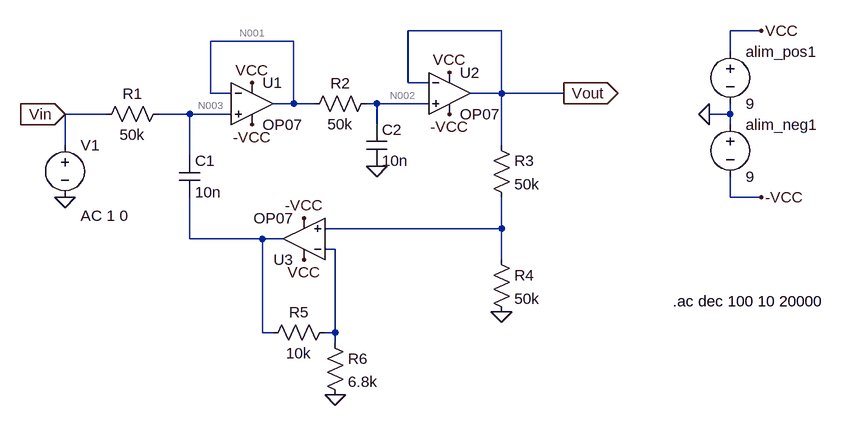
[diagram p0: schematic filtre_ordre_2_resonance.asc]
filtre_ordre_2_resonance.asc, the LTspice schematic file:
Version 4.1
SHEET 1 1324 836
WIRE 624 32 480 32
WIRE 1024 32 976 32
WIRE 304 48 176 48
WIRE 976 64 976 32
WIRE 480 112 480 32
WIRE 512 112 480 112
WIRE 176 128 176 48
WIRE 208 128 176 128
WIRE 624 128 624 32
WIRE 624 128 576 128
WIRE 720 128 624 128
WIRE 304 144 304 48
WIRE 304 144 272 144
WIRE 336 144 304 144
WIRE 432 144 416 144
WIRE 512 144 432 144
WIRE 16 160 -48 160
WIRE 144 160 96 160
WIRE 208 160 144 160
WIRE 976 160 976 144
WIRE 976 160 944 160
WIRE 432 176 432 144
WIRE 976 176 976 160
WIRE -48 208 -48 160
WIRE 624 208 624 128
WIRE 144 224 144 160
WIRE 976 288 976 256
WIRE 1024 288 976 288
WIRE 624 336 624 288
WIRE 624 336 352 336
WIRE 144 352 144 288
WIRE 256 352 144 352
WIRE 288 352 256 352
WIRE 368 368 352 368
WIRE 624 384 624 336
WIRE 256 496 256 352
WIRE 272 496 256 496
WIRE 368 496 368 368
WIRE 368 496 352 496
WIRE 368 512 368 496
FLAG 432 240 0
FLAG 624 464 0
FLAG 368 592 0
FLAG 720 128 Vout
IOPIN 720 128 Out
FLAG -48 160 Vin
IOPIN -48 160 In
FLAG -48 288 0
FLAG 944 160 0
FLAG 1024 32 VCC
FLAG 1024 288 -VCC
FLAG 240 112 VCC
FLAG 320 384 VCC
FLAG 544 96 VCC
FLAG 544 160 -VCC
FLAG 320 320 -VCC
FLAG 240 176 -VCC
SYMBOL res 112 144 R90
WINDOW 0 0 56 VBottom 2
WINDOW 3 32 56 VTop 2
SYMATTR InstName R1
SYMATTR Value 50k
SYMBOL cap 128 224 R0
SYMATTR InstName C1
SYMATTR Value 10n
SYMBOL cap 416 176 R0
SYMATTR InstName C2
SYMATTR Value 10n
SYMBOL res 432 128 R90
WINDOW 0 0 56 VBottom 2
WINDOW 3 32 56 VTop 2
SYMATTR InstName R2
SYMATTR Value 50k
SYMBOL res 608 192 R0
SYMATTR InstName R3
SYMATTR Value 50k
SYMBOL res 608 368 R0
SYMATTR InstName R4
SYMATTR Value 50k
SYMBOL res 368 480 R90
WINDOW 0 0 56 VBottom 2
WINDOW 3 32 56 VTop 2
SYMATTR InstName R5
SYMATTR Value 10k
SYMBOL res 352 496 R0
SYMATTR InstName R6
SYMATTR Value 6.8k
SYMBOL voltage -48 192 R0
WINDOW 123 24 124 Left 2
WINDOW 39 0 0 Left 0
SYMATTR Value2 AC 1 0
SYMATTR InstName V1
SYMATTR Value ""
SYMBOL OpAmps\\OP07 240 80 R0
SYMATTR InstName U1
SYMBOL OpAmps\\OP07 544 64 R0
SYMATTR InstName U2
SYMBOL OpAmps\\OP07 320 416 R180
SYMATTR InstName U3
SYMBOL voltage 976 48 R0
SYMATTR InstName alim_pos1
SYMATTR Value 9
SYMBOL voltage 976 160 R0
SYMATTR InstName alim_neg1
SYMATTR Value 9
TEXT 888 448 Left 2 !.ac dec 100 10 20000

The netlist it stands for:
* filtre_ordre_2_resonance.asc
R1 N003 Vin 50k
C1 N003 N005 10n
C2 N002 0 10n
R2 N002 N001 50k
R3 Vout N004 50k
R4 N004 0 50k
R5 N006 N005 10k
R6 N006 0 6.8k
V1 Vin 0 AC 1 0
X§U1 N003 N001 VCC -VCC N001 LT1001  ; OP07, pins In+ In- V+ V- OUT
X§U2 N002 Vout VCC -VCC Vout LT1001  ; OP07, pins In+ In- V+ V- OUT
X§U3 N004 N006 VCC -VCC N005 LT1001  ; OP07, pins In+ In- V+ V- OUT
V§alim_pos1 VCC 0 9
V§alim_neg1 0 -VCC 9
.ac dec 100 10 20000
.lib LTC.lib
.backanno
.end

* Results of the author's LTspice run, read from the files saved beside the schematic
* Operating Point, zero values left out:
*   V(-vcc) = -9 V
*   V(vcc) = 9 V
*   I(alim_neg1) = -6.75 mA
*   I(alim_pos1) = -6.75 mA
*   Ix(u2:3) = 2.25 mA
*   Ix(u2:4) = -2.25 mA
*   Ix(u1:3) = 2.25 mA
*   Ix(u1:4) = -2.25 mA
*   Ix(u3:3) = 2.25 mA
*   Ix(u3:4) = -2.25 mA
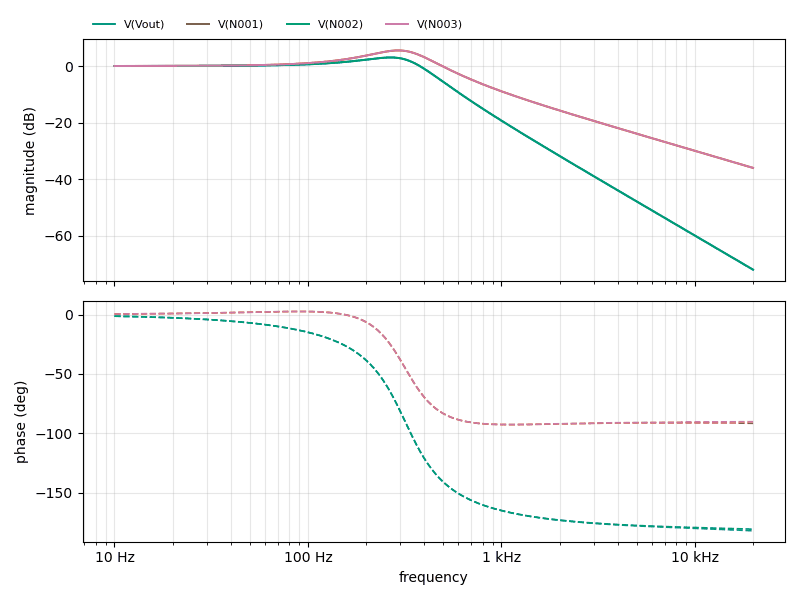
[diagram p1: AC Analysis of filtre_ordre_2_resonance.asc, plotted from the saved traces]
* AC Analysis, 1 run:
*   V(Vout): 0.01 dB at 10 Hz, -71.96 dB at 20 kHz, peak 3.02 dB at 269.2 Hz, 3 dB below the peak at 14.01 Hz and 378.1 Hz
*   V(N001): 0.01 dB at 10 Hz, -36.00 dB at 20 kHz, peak 5.52 dB at 295.1 Hz, 3 dB below the peak at 160.4 Hz and 417.2 Hz
*   V(N002): 0.01 dB at 10 Hz, -71.97 dB at 20 kHz, peak 3.02 dB at 269.2 Hz, 3 dB below the peak at 14.01 Hz and 378.1 Hz
*   V(N003): 0.01 dB at 10 Hz, -36.00 dB at 20 kHz, peak 5.52 dB at 295.1 Hz, 3 dB below the peak at 160.4 Hz and 417.2 Hz